# Altium schematic sheet MCU.SchDoc: Gravix Sensor V1
size A3; CheckedBy: Kanishka Nimesh; DrawnBy: Thilina Nuwarapaksha; Revision: A; SheetNumber: 2; SheetTotal: 8
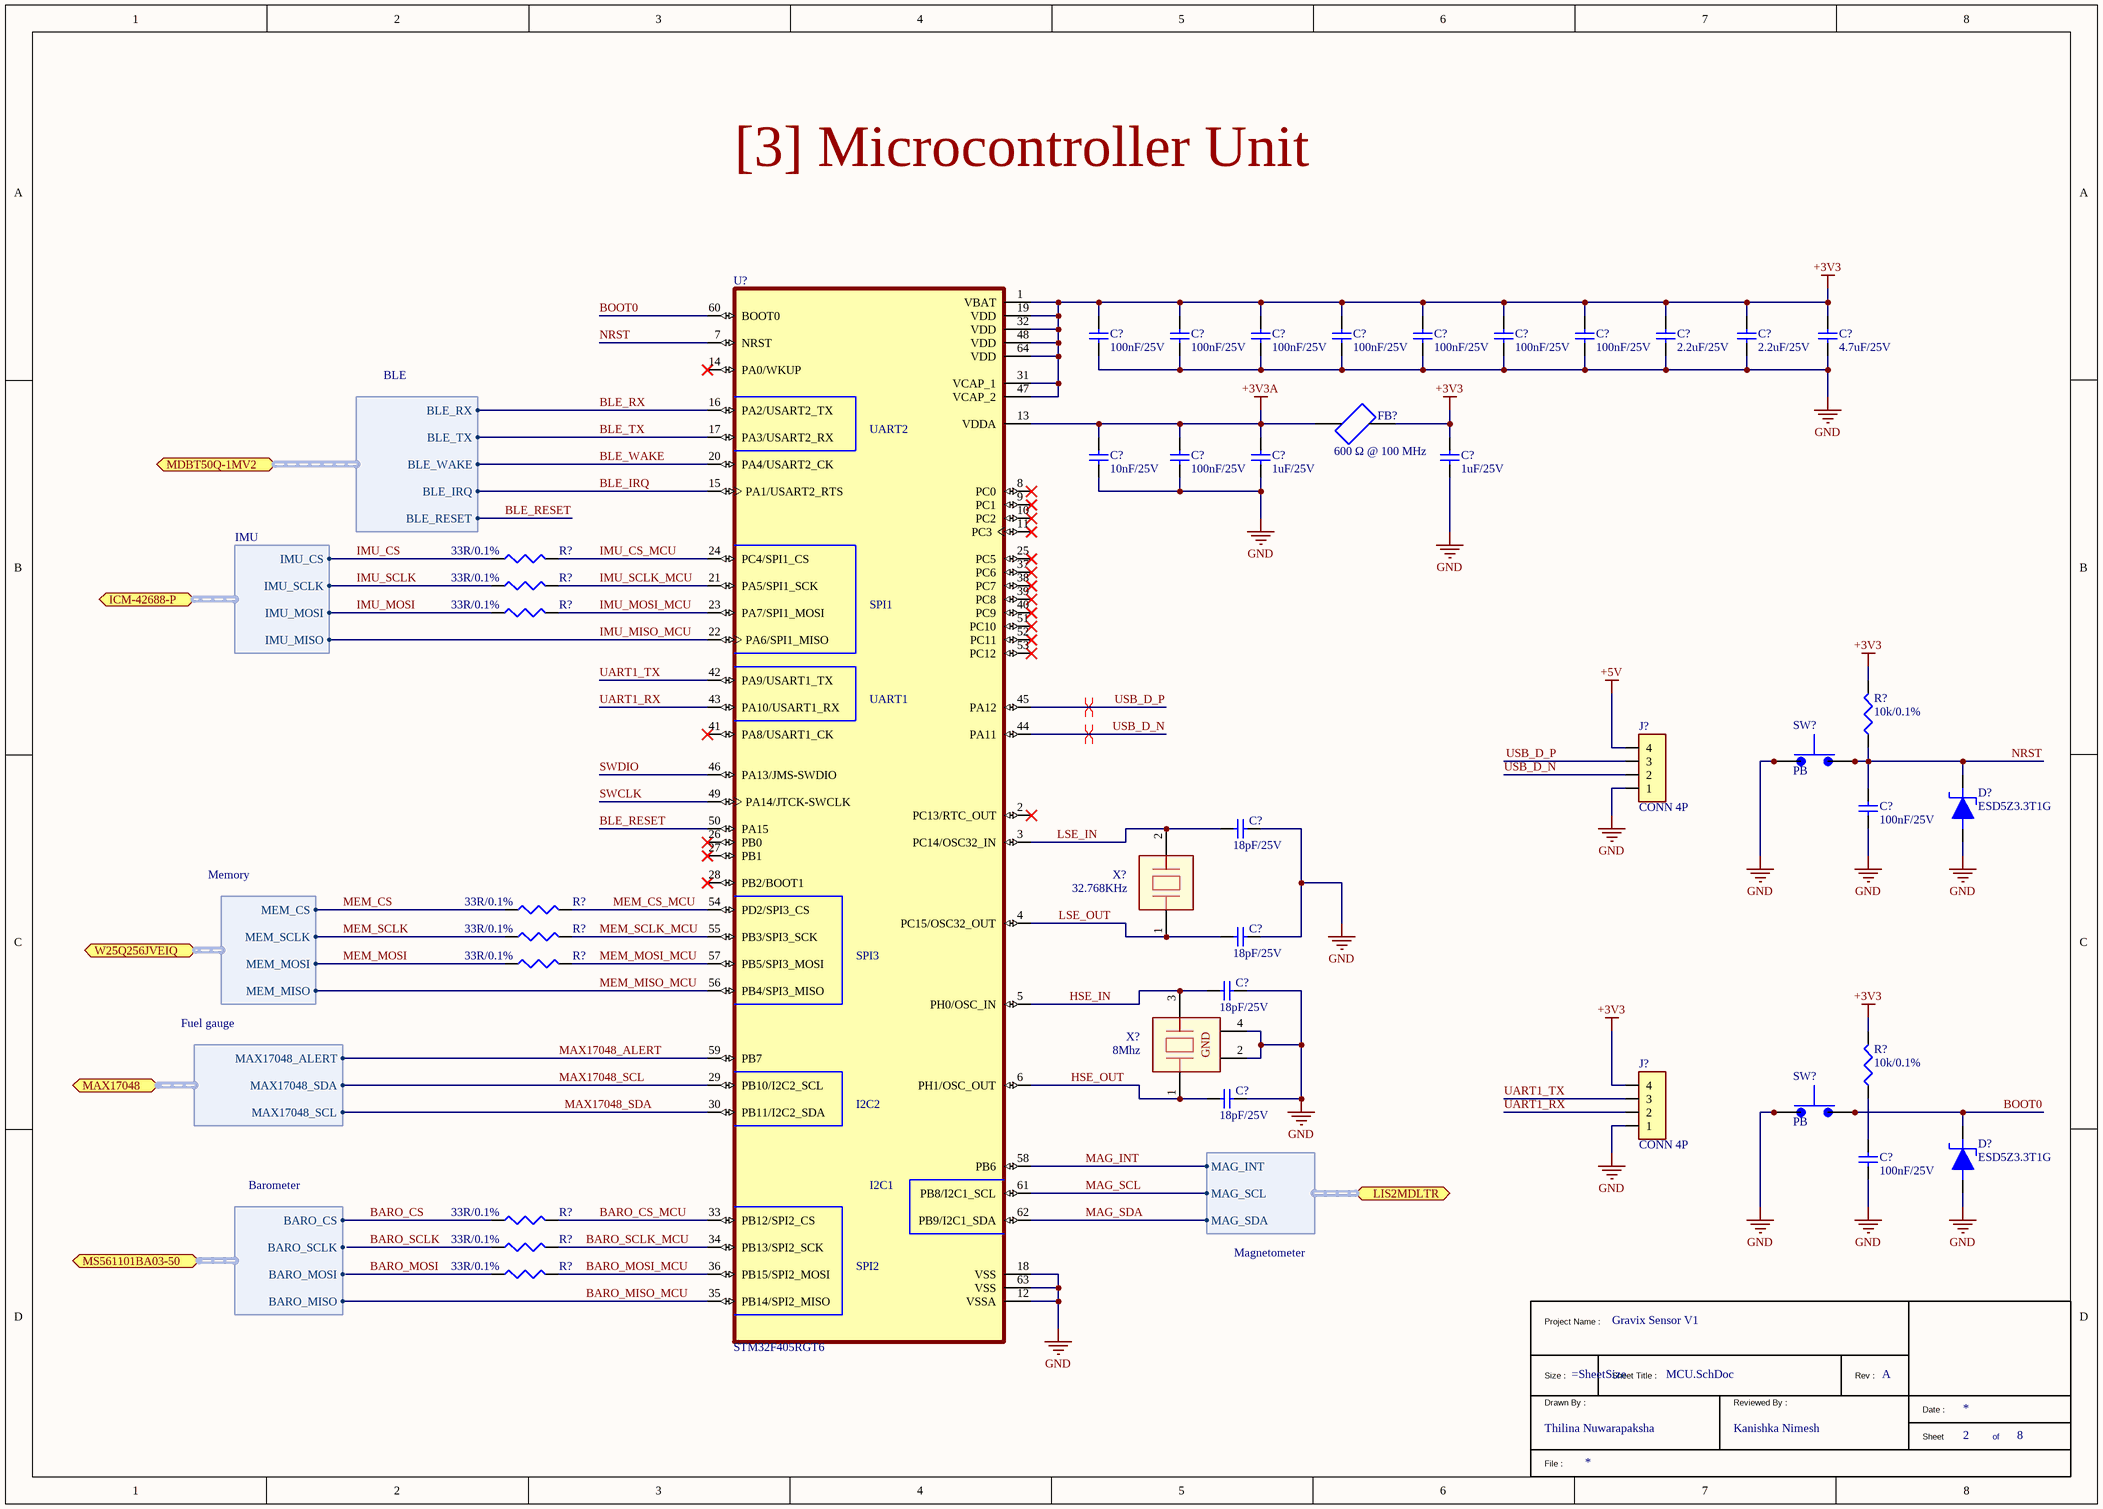
[diagram p0: MCU.SchDoc]

## Parts
(Parts that share a designator on the sheet are numbered #1, #2 ... from top to bottom, then left to right.)
*  TitleBlock1  (value not drawn)  (graphical)
C?#1  100nF/25V  [CAP_0402]
C?#2  100nF/25V  [CAP_0402]
C?#3  100nF/25V  [CAP_0402]
C?#4  100nF/25V  [CAP_0402]
C?#5  100nF/25V  [CAP_0402]
C?#6  100nF/25V  [CAP_0402]
C?#7  100nF/25V  [CAP_0402]
C?#8  2.2uF/25V  [CAP_0805]
C?#9  2.2uF/25V  [CAP_0805]
C?#10  4.7uF/25V  [CAP_0805]
C?#11  10nF/25V  [CAP_0402]
C?#12  100nF/25V  [CAP_0402]
C?#13  1uF/25V  [CAP_0805]
C?#14  1uF/25V  [CAP_0805]
C?#15  18pF/25V  [CAP_0402]
C?#16  100nF/25V  [CAP_0402]
C?#17  18pF/25V  [CAP_0402]
C?#18  18pF/25V  [CAP_0402]
C?#19  18pF/25V  [CAP_0402]
C?#20  100nF/25V  [CAP_0402]
D?#1  ESD5Z3.3T1G  [ESD5Z3.3T1G_SOD-523]
D?#2  ESD5Z3.3T1G  [ESD5Z3.3T1G_SOD-523]
FB?  600 Ω @ 100 MHz  [FB_1206]
J?#1  CONN 4P  [JST_SH_1.00]
J?#2  CONN 4P  [JST_SH_1.00]
R?#1  33R/0.1%  [RES_0402]
R?#2  33R/0.1%  [RES_0402]
R?#3  33R/0.1%  [RES_0402]
R?#4  10k/0.1%  [RES_0402]
R?#5  33R/0.1%  [RES_0402]
R?#6  33R/0.1%  [RES_0402]
R?#7  33R/0.1%  [RES_0402]
R?#8  10k/0.1%  [RES_0402]
R?#9  33R/0.1%  [RES_0402]
R?#10  33R/0.1%  [RES_0402]
R?#11  33R/0.1%  [RES_0402]
SW?#1  PB  [ALPSALPINE SKRPABE010]
SW?#2  PB  [ALPSALPINE SKRPABE010]
U?  STM32F405RGT6  [STM32F405RGT6_LQFP-64]
X?#1  32.768KHz  [32.768KHz_SMD2012-2P]
X?#2  8Mhz  [8MHz_SMD3225-4P]

## Ports
ICM-42688-P (bidir, harness IMU, see Block Diagram[3B], IMU[1B]), LIS2MDLTR (bidir, harness Magnetometer, see Block Diagram[3C], Magnetometer[1C]), MAX17048 (bidir, harness Fuel gauge, see Block Diagram[2B], Power[5D]), MDBT50Q-1MV2 (bidir, harness BLE, see Block Diagram[2C], BLE[3C]), MS561101BA03-50 (bidir, harness Barometer, see Block Diagram[3C], Barometer[1B]), W25Q256JVEIQ (bidir, harness Memory, see Block Diagram[2C], Memory[1B])

## Harnesses
IMU: IMU_CS, IMU_SCLK, IMU_MOSI, IMU_MISO
Memory: MEM_SCLK, MEM_MOSI, MEM_CS, MEM_MISO
Fuel gauge: MAX17048_SCL, MAX17048_SDA, MAX17048_ALERT
Magnetometer: MAG_SCL, MAG_SDA, MAG_INT
Barometer: BARO_CS, BARO_SCLK, BARO_MOSI, BARO_MISO
BLE: BLE_TX, BLE_RX, BLE_WAKE, BLE_RESET, BLE_IRQ

## Nets
+3V3: C?#1.2 C?#2.2 C?#3.2 C?#4.2 C?#5.2 C?#6.2 C?#7.2 C?#8.2 C?#9.2 C?#10.2 C?#14.2 FB?.2 J?#2.4 R?#4.2 R?#8.2 U?.1(VBAT) U?.19(VDD) U?.31(VCAP_1) U?.32(VDD) U?.47(VCAP_2) U?.48(VDD) U?.64(VDD)
+3V3A: C?#11.2 C?#12.2 C?#13.2 FB?.1 U?.13(VDDA)
+5V: J?#1.4
GND: C?#1.1 C?#2.1 C?#3.1 C?#4.1 C?#5.1 C?#6.1 C?#7.1 C?#8.1 C?#9.1 C?#10.1 C?#11.1 C?#12.1 C?#13.1 C?#14.1 C?#15.2 C?#16.1 C?#17.2 C?#18.2 C?#19.2 C?#20.1 D?#1.2 D?#2.2 J?#1.1 J?#2.1 SW?#1.1 SW?#1.2 SW?#2.1 SW?#2.2 U?.12(VSSA) U?.18(VSS) U?.63(VSS) X?#2.2(GND) X?#2.4(GND)
BARO_CS: R?#9.1 ; port MS561101BA03-50.BARO_CS
BARO_CS_MCU: R?#9.2 U?.33(PB12/SPI2_CS)
BARO_MISO_MCU: U?.35(PB14/SPI2_MISO)
BARO_MOSI: R?#11.1
BARO_MOSI_MCU: R?#11.2 U?.36(PB15/SPI2_MOSI)
BARO_SCLK: R?#10.1
BARO_SCLK_MCU: R?#10.2 U?.34(PB13/SPI2_SCK)
BLE_IRQ: U?.15(PA1/USART2_RTS) ; port MDBT50Q-1MV2.BLE_IRQ
BLE_RESET: U?.50(PA15) ; port MDBT50Q-1MV2.BLE_RESET
BLE_RX: U?.16(PA2/USART2_TX) ; port MDBT50Q-1MV2.BLE_RX
BLE_TX: U?.17(PA3/USART2_RX) ; port MDBT50Q-1MV2.BLE_TX
BLE_WAKE: U?.20(PA4/USART2_CK) ; port MDBT50Q-1MV2.BLE_WAKE
BOOT0: D?#2.1 SW?#2.3 SW?#2.4 U?.60(BOOT0)
HSE_IN: C?#18.1 U?.5(PH0/OSC_IN) X?#2.3
HSE_OUT: C?#19.1 U?.6(PH1/OSC_OUT) X?#2.1
IMU_CS: R?#1.1 ; port ICM-42688-P.IMU_CS
IMU_CS_MCU: R?#1.2 U?.24(PC4/SPI1_CS)
IMU_MISO_MCU: U?.22(PA6/SPI1_MISO) ; port ICM-42688-P.IMU_MISO
IMU_MOSI: R?#3.1 ; port ICM-42688-P.IMU_MOSI
IMU_MOSI_MCU: R?#3.2 U?.23(PA7/SPI1_MOSI)
IMU_SCLK: R?#2.1 ; port ICM-42688-P.IMU_SCLK
IMU_SCLK_MCU: R?#2.2 U?.21(PA5/SPI1_SCK)
LSE_IN: C?#15.1 U?.3(PC14/OSC32_IN) X?#1.2(GND)
LSE_OUT: C?#17.1 U?.4(PC15/OSC32_OUT) X?#1.1
MAG_INT: U?.58(PB6) ; port LIS2MDLTR.MAG_INT
MAG_SCL: U?.61(PB8/I2C1_SCL) ; port LIS2MDLTR.MAG_SCL
MAG_SDA: U?.62(PB9/I2C1_SDA) ; port LIS2MDLTR.MAG_SDA
MAX17048_ALERT: U?.59(PB7) ; port MAX17048.MAX17048_ALERT
MAX17048_SCL: U?.29(PB10/I2C2_SCL) ; port MAX17048.MAX17048_SDA
MAX17048_SDA: U?.30(PB11/I2C2_SDA) ; port MAX17048.MAX17048_SCL
MEM_CS: R?#5.1 ; port W25Q256JVEIQ.MEM_CS
MEM_CS_MCU: R?#5.2 U?.54(PD2/SPI3_CS)
MEM_MISO_MCU: U?.56(PB4/SPI3_MISO) ; port W25Q256JVEIQ.MEM_MISO
MEM_MOSI: R?#7.1 ; port W25Q256JVEIQ.MEM_MOSI
MEM_MOSI_MCU: R?#7.2 U?.57(PB5/SPI3_MOSI)
MEM_SCLK: R?#6.1 ; port W25Q256JVEIQ.MEM_SCLK
MEM_SCLK_MCU: R?#6.2 U?.55(PB3/SPI3_SCK)
NRST: C?#16.2 D?#1.1 R?#4.1 SW?#1.3 SW?#1.4 U?.7(NRST)
SWCLK: U?.49(PA14/JTCK-SWCLK)
SWDIO: U?.46(PA13/JMS-SWDIO)
UART1_RX: J?#2.2 U?.43(PA10/USART1_RX)
UART1_TX: J?#2.3 U?.42(PA9/USART1_TX)
USB_D_N: J?#1.2 U?.44(PA11)
USB_D_P: J?#1.3 U?.45(PA12)
NetC?#20_2: C?#20.2 R?#8.1

Not connected (* = marked no-connect by the designer): U? 2(PC13/RTC_OUT)* 8(PC0)* 9(PC1)* 10(PC2)* 11(PC3)* 14(PA0/WKUP)* 25(PC5)* 26(PB0)* 27(PB1)* 28(PB2/BOOT1)* 37(PC6)* 38(PC7)* 39(PC8)* 40(PC9)* 41(PA8/USART1_CK)* 51(PC10)* 52(PC11)* 53(PC12)*

## Layout directives
differential pair: USB_D_N, USB_D_P

## Notes on the sheet
- [3] Microcontroller Unit
- (in symbol ST STM32F405RGT6) UART2; SPI1; UART1; SPI3; I2C2; I2C1; SPI2
- (in symbol TitleBlock1) Project Name :; Size :; Sheet Title :; Rev :; Drawn By :; Reviewed By :; Date :; Sheet; of; File :

## Library data of the parts
C?#1-C?#7 C?#12 C?#16 C?#20 = YAGEO CC0402JRX7R8BB104: 100nF ±5% 25V Ceramic Capacitor X7R 0402; Manufacturer: YAGEO; Manufacturer Part Number: CC0402JRX7R8BB104; LCSC Part Number: C541465; Package: 0402; Mounting Type: SMD; ComponentLink2Description: Digikey Link; ComponentLink3Description: LCSC Link; ComponentLink3URL: https://www.lcsc.com/product-detail/C541465.html?spm=wm.fly.bg.0.xh___wm.fly.dhl.mly.12-0-4&lcsc_vid=QlAIX1RQQQJfX1VRTwcNAQJXTlRaUQBVEQBYAwJfFFcxVlNRQFhYU1xWRFVdXztW
C?#8 C?#9 = YAGEO CC0805KKX7R8BB225: 2.2uF ±10% 25V Ceramic Capacitor X7R 0805; Manufacturer: YAGEO; Manufacturer Part Number: CC0805KKX7R8BB225; LCSC Part Number: C277470; Package: 0805; Mounting Type: SMD; ComponentLink2Description: Digikey Link; ComponentLink3Description: LCSC Link; ComponentLink3URL: https://www.lcsc.com/product-detail/C277470.html?spm=wm.fly.bg.0.xh___wm.sy.dhl.mly.12-0-4&lcsc_vid=QlAIX1RQQQJfX1VRTwcNAQJXTlRaUQBVEQBYAwJfFFcxVlNRT1BcUFBQTlRYVTtW
C?#10 = YAGEO CC0805KKX7R8BB475: 4.7uF ±10% 25V Ceramic Capacitor X7R 0805; Manufacturer: YAGEO; Manufacturer Part Number: CC0805KKX7R8BB475; LCSC Part Number: C354262; Package: 0805; Mounting Type: SMD; ComponentLink2Description: Digikey Link; ComponentLink3Description: LCSC Link; ComponentLink3URL: https://www.lcsc.com/product-detail/C354262.html?spm=wm.fly.bg.0.xh___wm.sy.dhl.mly.12-0-4&lcsc_vid=QlAIX1RQQQJfX1VRTwcNAQJXTlRaUQBVEQBYAwJfFFcxVlNRT1BXUFVTRlNXVDtW
C?#11 = YAGEO CC0402JRX7R8BB103: 10nF ±5% 25V Ceramic Capacitor X7R 0402; Manufacturer: YAGEO; Manufacturer Part Number: CC0402JRX7R8BB103; LCSC Part Number: C541443; Package: 0402; Mounting Type: SMD; ComponentLink2Description: Digikey Link; ComponentLink3Description: LCSC Link; ComponentLink3URL: https://www.lcsc.com/product-detail/C541443.html?spm=wm.fly.bg.0.xh___wm.sy.dhl.mly.12-0-4&lcsc_vid=QlAIX1RQQQJfX1VRTwcNAQJXTlRaUQBVEQBYAwJfFFcxVlNRT1BcUFBQTlRYVTtW
C?#13 C?#14 = YAGEO CC0805KKX7R8BB105: 1uF ±10% 25V Ceramic Capacitor X7R 0805; Manufacturer: YAGEO; Manufacturer Part Number: CC0805KKX7R8BB105; LCSC Part Number: C91186; Package: 0805; Mounting Type: SMD; ComponentLink2Description: Digikey Link; ComponentLink3Description: LCSC Link; ComponentLink3URL: https://www.lcsc.com/product-detail/C91186.html?spm=wm.fly.bg.0.xh___wm.fly.dhl.mly.12-0-4&lcsc_vid=QlAIX1RQQQJfX1VRTwcNAQJXTlRaUQBVEQBYAwJfFFcxVlNRT1FbV1FfR1JZUDsOAxUeFF5JWBYZEEoKFBINSQcJGk4dAgUUFAk%3D
C?#15 C?#17-C?#19 = YAGEO CC0402GRNPO8BN180: 18pF ±2% 25V Ceramic Capacitor NP0 0402; Manufacturer: YAGEO; Manufacturer Part Number: CC0402GRNPO8BN180; LCSC Part Number: C526984; Package: 0402; Mounting Type: SMD; ComponentLink2Description: Digikey Link; ComponentLink3Description: LCSC Link; ComponentLink3URL: https://www.lcsc.com/product-detail/C526984.html?spm=wm.fly.bg.0.xh___wm.fly.dhl.mly.12-0-4&lcsc_vid=QlAIX1RQQQJfX1VRTwcNAQJXTlRaUQBVEQBYAwJfFFcxVlNRQFhYU1xWRFVdXztW
D?#1 D?#2 = onsemi ESD5Z3.3T1G: TVS DIODE 3.3VWM 14.1VC SOD-523; Manufacturer: onsemi; Manufacturer Part Number: ESD5Z3.3T1G; LCSC Part Number: C61148; Package: SOD-523; ComponentLink1Description: Digikey Link; ComponentLink2Description: LCSC Link; ComponentLink2URL: https://www.lcsc.com/product-detail/C61148.html?s_z=n_ESD5Z3.3T1G; Mounting Type: SMD
FB? = TAI-TECH HCB3216KF-601T20: 600Ω@100MHz 1 Line Ferrite Bead 1206 1A 100mΩ; Manufacturer: TAI-TECH; Manufacturer Part Number: HCB3216KF-601T20; LCSC Part Number: C127295; Package: 1206; Mounting Type: SMD; ComponentLink2Description: Digikey Link; ComponentLink3Description: LCSC Link; ComponentLink3URL: https://www.lcsc.com/product-detail/C127295.html?spm=wm.fly.bg.0.xh&lcsc_vid=QlAIX1RQQQJfX1VRTwcNAQJXTlRaUQBVEQBYAwJfFFcxVlNRT1FaVFJTQVhWUjsOAxUeFF5JWBYZEEoBGA4JCwFIFA4DSA%3D%3D
J?#1 J?#2 = JST_4P_SH: Connector Header 4 position 1mm Pitch 1A Surface Mount, Right Angle -25℃~+85℃; Manufacturer: JST; Manufacturer Part Number: SM04B-SRSS-TB(LF)(SN); LCSC Part Number: C160404; Package: SMD,P=1mm,Surface Mount,Right Angle; ComponentLink1Description: Digikey Link; Mounting Type: SMD; ComponentLink2Description: LCSC Link; ComponentLink2URL: https://www.lcsc.com/product-detail/C160404.html?spm=wm.fly.bg.0.xh&lcsc_vid=QlAIX1RQQQJfX1VRTwcNAQJXTlRaUQBVEQBYAwJfFFcxVlNRT1RYUldfQ1BaVTsOAxUeFF5JWBYZEEoKFBINSQcJGk4NBhADEA4cHktRTlNADxALGw%3D%3D
R?#1-R?#3 R?#5-R?#7 R?#9-R?#11 = YAGEO RT0402BRD0733RL: 33Ω 63mW 50V Thin Film Resistor ±25ppm/℃ ±0.1% 0402 Chip Resistor - Surface Mount RoHS; Manufacturer: YAGEO; Manufacturer Part Number: RT0402BRD0733RL; LCSC Part Number: C852729; Package: 0402; ComponentLink1Description: Digikey Link; Mounting Type: SMD; ComponentLink2Description: LCSC Link; ComponentLink2URL: https://www.lcsc.com/product-detail/C852729.html?spm=wm.fly.bg.0.xh___wm.fly.dhl.mly.12-6-1&lcsc_vid=QlAIX1RQQQJfX1VRTwcNAQJXTlRaUQBVEQBYAwJfFFcxVlNRT1BXUFVTRlNXVDtW
R?#4 R?#8 = YAGEO RT0402BRD0710KL: 62.5mW 10kΩ 50V Thin Film Resistor ±25ppm/℃ ±0.1% 0402 Chip Resistor - Surface Mount RoHS; Manufacturer: YAGEO; Manufacturer Part Number: RT0402BRD0710KL; LCSC Part Number: C190095; Package: 0402; ComponentLink1Description: Digikey Link; Mounting Type: SMD; ComponentLink2Description: LCSC Link; ComponentLink2URL: https://www.lcsc.com/product-detail/C190095.html?spm=wm.fly.bg.0.xh___wm.fly.dhl.mly.12-6-1&lcsc_vid=QlAIX1RQQQJfX1VRTwcNAQJXTlRaUQBVEQBYAwJfFFcxVlNRT1FbV1FfR1JZUDsOAxUeFF5JWBYZEEoKFBINSQcJGk4dAgUUFAk%3D
SW?#1 SW?#2 = ALPSALPINE SKRPABE010: Tactile Switch SPST 2.5mm 4.2mm x 3.2mm Surface Mount; Manufacturer: ALPSALPINE; Manufacturer Part Number: SKRPABE010; LCSC Part Number: C115360; Package: SMD-4P,4.2x3.2mm; ComponentLink1Description: Digikey Link; ComponentLink2Description: LCSC Link; ComponentLink2URL: https://www.lcsc.com/product-detail/C115360.html?s_z=n_C115360; Mounting Type: SMD
U? = ST STM32F405RGT6: ARM Cortex-M4 32b MCU+FPU, 210DMIPS, up to 1MB Flash/192+4KB RAM, USB OTG HS/FS, Ethernet, 17 TIMs, 3 ADCs, 15 comm. interfaces & camera; Manufacturer: ST; Manufacturer Part Number: STM32F405RGT6; LCSC Part Number: C15742; Package: LQFP-64(10x10); Mounting Type: SMD; ComponentLink2Description: Digikey Link; ComponentLink3Description: LCSC Link; ComponentLink3URL: https://www.lcsc.com/product-detail/C15742.html?s_z=n_q_STM32F405RGT6&spm=wm.ssy.bg.0.xh&lcsc_vid=QlAIX1RQQQJfX1VRTwcNAQJXTlRaUQBVEQBYAwJfFFcxVlNRQFhZVVBQQ1RcXjsOAxUeFF5JWBYZEEoKFBINSQcJGk4NBhADEA4cHktXRlVcSQwSGg0%3D
X?#1 = 32.768KHz 2P: Crystal 32.768kHz ±20ppm 12.5pF SMD2012-2P; Manufacturer: KYX; Manufacturer Part Number: K2A32768125202; LCSC Part Number: C19076730; Package: SMD2012-2P; ComponentLink1Description: Digikey Link; ComponentLink2Description: LCSC Link; ComponentLink2URL: https://www.lcsc.com/product-detail/C19076730.html?spm=wm.fly.bg.2.xh___wm.sxq.dhl.mly.12-1-1&lcsc_vid=QlAIX1RQQQJfX1VRTwcNAQJXTlRaUQBVEQBYAwJfFFcxVlNRQFhYU1xWRFVdXztW; Mounting Type: SMD
X?#2 = 8MHz 4P: Crystal 8MHz ±10ppm 12pF 40Ω SMD3225-4P; Manufacturer: huaxindianzi; Manufacturer Part Number: CF4008M00012001; LCSC Part Number: C7294546; Package: SMD3225-4P; ComponentLink1Description: Digikey Link; ComponentLink2Description: LCSC Link; ComponentLink2URL: https://www.lcsc.com/product-detail/C7294546.html?spm=wm.fly.bg.0.xh___wm.sxq.dhl.mly.12-1-1&lcsc_vid=QlAIX1RQQQJfX1VRTwcNAQJXTlRaUQBVEQBYAwJfFFcxVlNRQFhYU1xWRFVdXztW; Mounting Type: SMD